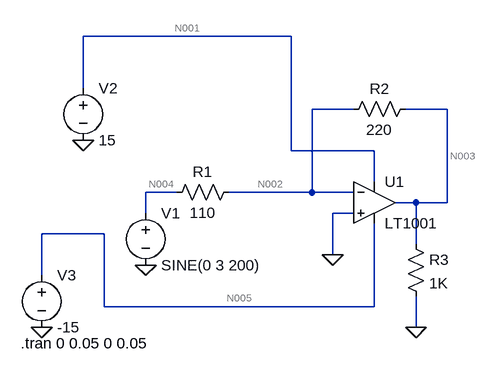
[diagram p0: schematic inverting Op-Amp.asc]
inverting Op-Amp.asc, the LTspice schematic file:
Version 4
SHEET 1 880 680
WIRE 160 -64 -160 -64
WIRE -160 16 -160 -64
WIRE 256 48 192 48
WIRE 400 48 336 48
WIRE 160 112 160 -64
WIRE 288 112 160 112
WIRE 288 160 288 112
WIRE -16 176 -64 176
WIRE 192 176 192 48
WIRE 192 176 64 176
WIRE 256 176 192 176
WIRE 352 192 320 192
WIRE 400 192 400 48
WIRE 400 192 352 192
WIRE -64 208 -64 176
WIRE 256 208 224 208
WIRE -128 240 -224 240
WIRE 352 256 352 192
WIRE 224 272 224 208
WIRE -224 304 -224 240
WIRE -128 352 -128 240
WIRE 288 352 288 224
WIRE 288 352 -128 352
WIRE 352 384 352 336
FLAG -160 96 0
FLAG -64 288 0
FLAG -224 384 0
FLAG 224 272 0
FLAG 352 384 0
SYMBOL OpAmps\\LT1001 288 128 R0
SYMATTR InstName U1
SYMBOL res 80 160 R90
WINDOW 0 0 56 VBottom 2
WINDOW 3 32 56 VTop 2
SYMATTR InstName R1
SYMATTR Value 110
SYMBOL res 352 32 R90
WINDOW 0 0 56 VBottom 2
WINDOW 3 32 56 VTop 2
SYMATTR InstName R2
SYMATTR Value 220
SYMBOL voltage -64 192 R0
WINDOW 123 0 0 Left 0
WINDOW 39 0 0 Left 0
SYMATTR InstName V1
SYMATTR Value SINE(0 3 200)
SYMBOL voltage -160 0 R0
WINDOW 123 0 0 Left 0
WINDOW 39 0 0 Left 0
SYMATTR InstName V2
SYMATTR Value 15
SYMBOL voltage -224 288 R0
WINDOW 123 0 0 Left 0
WINDOW 39 0 0 Left 0
SYMATTR InstName V3
SYMATTR Value -15
SYMBOL res 336 240 R0
SYMATTR InstName R3
SYMATTR Value 1K
TEXT -256 408 Left 2 !.tran 0 0.05 0 0.05

The netlist it stands for:
* inverting Op-Amp.asc
XU1 0 N002 N001 N005 N003 LT1001  ; pins In+ In- V+ V- OUT
R1 N002 N004 110
R2 N003 N002 220
V1 N004 0 SINE(0 3 200)
V2 N001 0 15
V3 N005 0 -15
R3 N003 0 1K
.tran 0 0.05 0 0.05
.lib LTC.lib
.backanno
.end

* Results of the author's LTspice run, read from the files saved beside the schematic
* Operating Point, zero values left out:
*   V(n001) = 15 V
*   V(n005) = -15 V
*   I(V3) = 2.25 mA
*   I(V2) = -2.25 mA
*   Ix(u1:3) = 2.25 mA
*   Ix(u1:4) = -2.25 mA
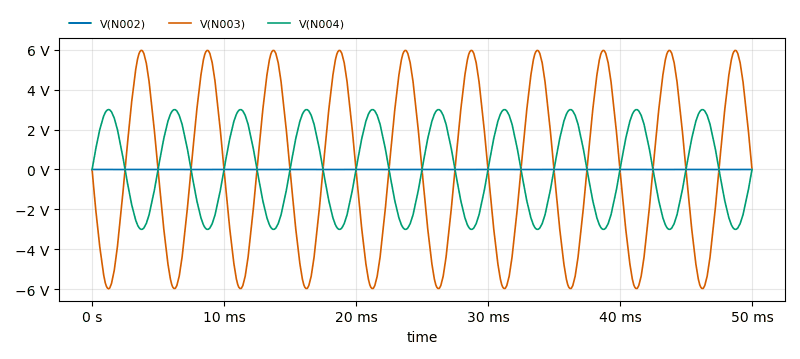
[diagram p1: Transient Analysis of inverting Op-Amp.asc, plotted from the saved traces]
* Transient Analysis, 1 run:
*   V(N002): min -3.184 mV, max 3.268 mV, average 1.213 µV, rms 1.494 mV, last 1.673 mV
*   V(N003): min -5.973 V, max 5.963 V, average 86.32 µV, rms 4.21 V, last 5.02 mV
*   V(N004): min -2.997 V, max 3 V, average 0 V, rms 2.141 V, last 0 V